# EAGLE design mini_controller_m328 (EAGLE 9.6.2)
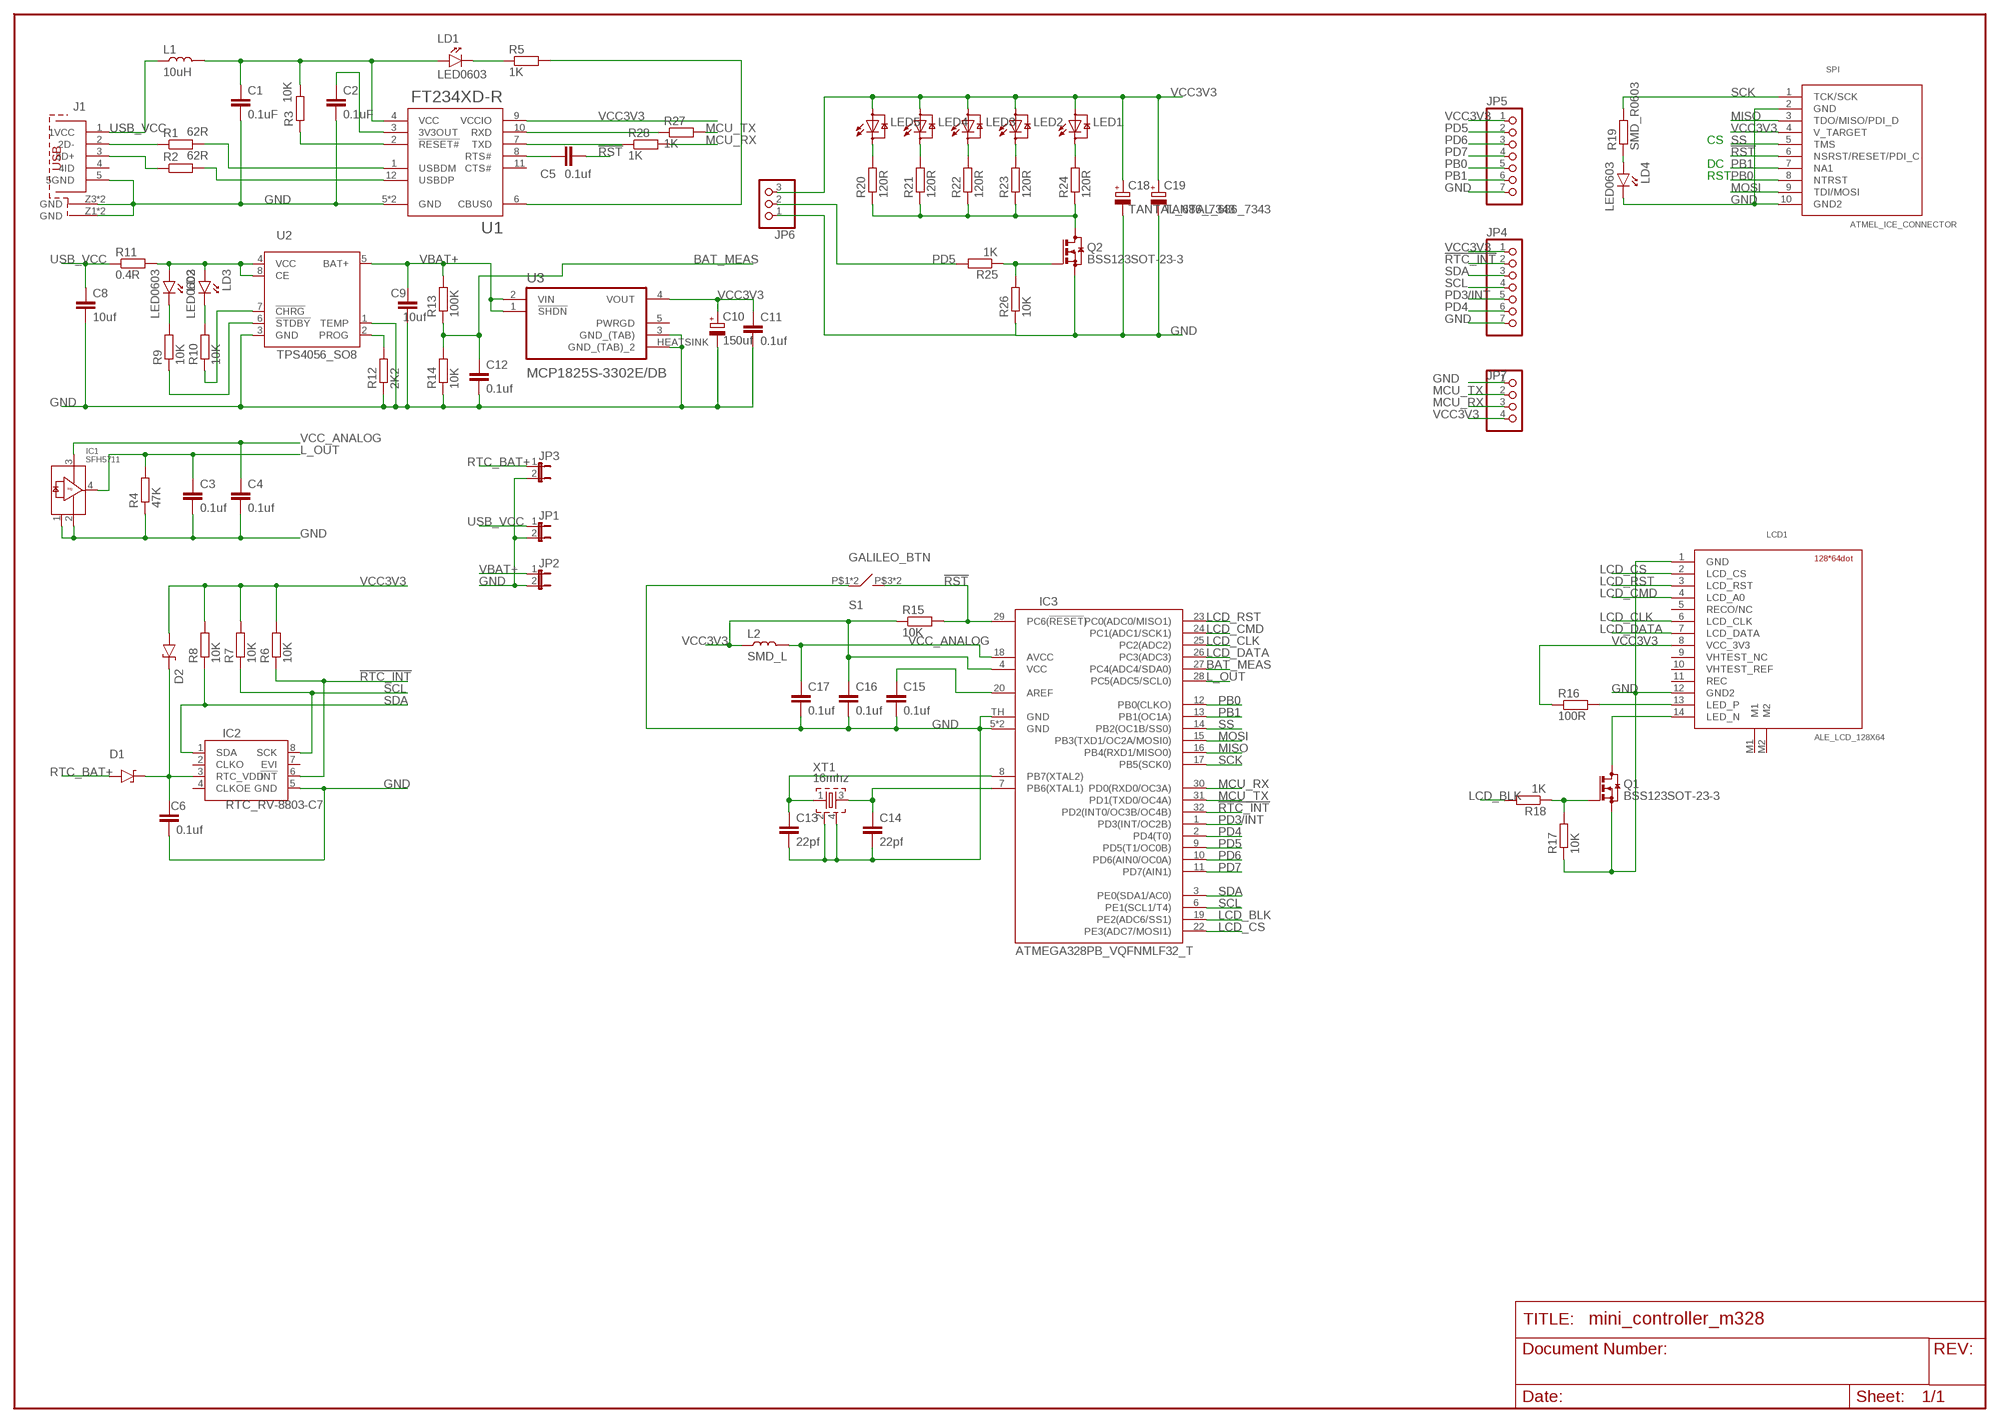
[diagram p0: schematic, sheet 1]

## Parts
C1  0.1uF  SMD_C0603  [0603]
C2  0.1uF  SMD_C0603  [0603]
C3  0.1uf  SMD_C0603  [0603]
C4  0.1uf  SMD_C0603  [0603]
C5  0.1uf  SMD_C0603  [0603]
C6  0.1uf  SMD_C0603  [0603]
C8  10uf  SMD_C1206  [1206]
C9  10uf  SMD_C1206  [1206]
C10  150uf  TANTAL_150UF_3528  [KA-3528ASYC]
C11  0.1uf  SMD_C0603  [0603]
C12  0.1uf  SMD_C0603  [0603]
C13  22pf  SMD_C0603  [0603]
C14  22pf  SMD_C0603  [0603]
C15  0.1uf  SMD_C0603  [0603]
C16  0.1uf  SMD_C0603  [0603]
C17  0.1uf  SMD_C0603  [0603]
C18  TANTAL_686_7343  [D/7343-31R]
C19  TANTAL_686_7343  [D/7343-31R]
D1  D_SOD323  [SOD-323_D]
D2  D_SOD323  [SOD-323_D]
IC1  SFH5711  [SFH5711]
IC2  RTC_RV-8803-C7  [C7_RTC]
IC3  ATMEGA328PB_VQFNMLF32_T  [MLF32-TH]
J1  MINI_USB_TYP_B_@  [65100516121]
JP1  JP1E  [JP1]
JP2  JP1E  [JP1]
JP3  JP1E  [JP1]
JP4  PINHD-1X7  [1X07]
JP5  PINHD-1X7  [1X07]
JP6  PINHD-1X3  [1X03]
JP7  PINHD-1X4  [1X04]
L1  10uH  SMD_L  [0805]
L2  SMD_L  [0805]
LCD1  ALE_LCD_128X64  [ALE_LCD_14PIN_CONNECTOR]
LD1  LED0603  [0603_P]
LD2  LED0603  [0603_P]
LD3  LED0603  [0603_P]
LD4  LED0603  [0603_P]
LED1  GM5BW96385A  [GM5BW96385A]
LED2  GM5BW96385A  [GM5BW96385A]
LED3  GM5BW96385A  [GM5BW96385A]
LED4  GM5BW96385A  [GM5BW96385A]
LED5  GM5BW96385A  [GM5BW96385A]
Q1  BSS123SOT-23-3  [SOT-23(3)]
Q2  BSS123SOT-23-3  [SOT-23(3)]
R1  62R  SMD_R0603  [0603]
R2  62R  SMD_R0603  [0603]
R3  10K  SMD_R0603  [0603]
R4  47K  SMD_R0603  [0603]
R5  1K  SMD_R0603  [0603]
R6  10K  SMD_R0603  [0603]
R7  10K  SMD_R0603  [0603]
R8  10K  SMD_R0603  [0603]
R9  10K  SMD_R0603  [0603]
R10  10K  SMD_R0603  [0603]
R11  0.4R  SMD_R1206  [1206]
R12  2K2  SMD_R0603  [0603]
R13  100K  SMD_R0603  [0603]
R14  10K  SMD_R0603  [0603]
R15  10K  SMD_R0603  [0603]
R16  100R  SMD_R0603  [0603]
R17  10K  SMD_R0603  [0603]
R18  1K  SMD_R0603  [0603]
R19  SMD_R0603  [0603]
R20  120R  SMD_R1206  [1206]
R21  120R  SMD_R1206  [1206]
R22  120R  SMD_R1206  [1206]
R23  120R  SMD_R1206  [1206]
R24  120R  SMD_R1206  [1206]
R25  1K  SMD_R0603  [0603]
R26  10K  SMD_R0603  [0603]
R27  1K  SMD_R0603  [0603]
R28  1K  SMD_R0603  [0603]
S1  GALILEO_BTN  [GALILEO_VERT_BTN]
SPI  ATMEL_ICE_CONNECTOR  [MINI10P_SPI/JTAG/PDI]
U1  FT234XD-R  [IC_FT234XD-R]
U2  TPS4056_SO8  [SO8]
U3  MCP1825S-3302E/DB  [SOT230P700X180-4N]
XT1  16mhz  QUARTZ_ZQ  [QUARTZ_3X3MM]

## Nets
!CHRG: R10.1 U2.7(!CHRG)
!RST: C5.2 IC3.29(PC6(!RESET!)) R15.2 S1.P$3 S1.P$4 SPI.6(NSRST/RESET/PDI_C)
!RTC_INT: IC2.6(!INT) IC3.32(PD2(INT0/OC3B/OC4B)) JP4.2 R6.1
BAT_MEAS: C12.1 IC3.27(PC4(ADC4/SDA0)) R13.1 R14.2
DM1: J1.2(2D-) R1.1
DM2: R1.2 U1.1(USBDM)
DP1: J1.3(3D+) R2.1
DP2: R2.2 U1.12(USBDP)
GND: C1.2 C2.2 C3.2 C4.2 C6.2 C8.2 C9.2 C10.M(-) C11.2 C12.2 C13.2 C14.2 C15.2 C16.2 C17.2 C18.- C19.- IC1.1 IC1.2 IC2.5(GND) IC3.5(GND) IC3.21(GND) IC3.TH(GND) J1.5(5GND) J1.Z1(GND) J1.Z2(GND) J1.Z3(GND) J1.Z4(GND) JP1.2 JP2.2 JP3.2 JP4.7 JP5.7 JP6.1 JP7.1 LCD1.1(GND) LCD1.12(GND2) LD4.1(K) Q1.2(S) Q2.2(S) R4.1 R12.1 R14.1 R17.1 R26.1 S1.P$1 S1.P$2 SPI.2(GND) SPI.10(GND2) U1.5(GND) U1.13(GND) U2.1(TEMP) U2.3(GND) U3.3(GND_(TAB)) U3.HEATSINK(GND_(TAB)_2) XT1.2 XT1.4
L_OUT: C3.1 IC1.4 IC3.28(PC5(ADC5/SCL0)) R4.2
LCD_BLK: IC3.19(PE2(ADC6/SS1)) R18.2
LCD_CLK: IC3.25(PC2(ADC2)) LCD1.6(LCD_CLK)
LCD_CMD: IC3.24(PC1(ADC1/SCK1)) LCD1.4(LCD_A0)
LCD_CS: IC3.22(PE3(ADC7/MOSI1)) LCD1.2(LCD_CS)
LCD_DATA: IC3.26(PC3(ADC3)) LCD1.7(LCD_DATA)
LCD_RST: IC3.23(PC0(ADC0/MISO1)) LCD1.3(LCD_RST)
MCU_RX: IC3.30(PD0(RXD0/OC3A)) JP7.3 R28.2
MCU_TX: IC3.31(PD1(TXD0/OC4A)) JP7.2 R27.2
MISO: IC3.16(PB4(RXD1/MISO0)) SPI.3(TDO/MISO/PDI_D)
MOSI: IC3.15(PB3(TXD1/OC2A/MOSI0)) SPI.9(TDI/MOSI)
N$1: LCD1.13(LED_P) R16.2
N$2: LCD1.14(LED_N) Q1.3(D)
N$3: R9.1 U2.6(!STDBY)
N$4: Q1.1(G) R17.2 R18.1
N$5: LD2.1(K) R9.2
N$6: LD3.1(K) R10.2
N$7: C1.1 L1.2 LD1.2(A) R3.2 U1.4(VCC)
N$8: C13.1 IC3.8(PB7(XTAL2)) XT1.1
N$9: C2.1 U1.3(3V3OUT)
N$10: LD1.1(K) R5.1
N$11: R5.2 U1.6(CBUS0)
N$12: C14.1 IC3.7(PB6(XTAL1)) XT1.3
N$13: LD2.2(A) LD3.2(A) R11.2 U2.4(VCC) U2.8(CE)
N$14: R27.1 U1.10(RXD)
N$15: C5.1 U1.8(RTS#)
N$16: LD4.2(A) R19.1
N$17: LED5.C R20.2
N$18: R12.2 U2.2(PROG)
N$19: C6.1 D1.K D2.K IC2.3(RTC_VDD)
N$20: C15.1 IC3.20(AREF)
N$21: LED4.C R21.2
N$22: LED3.C R22.2
N$23: LED2.C R23.2
N$24: LED1.C R24.2
N$25: Q2.1(G) R25.1 R26.2
N$26: Q2.3(D) R20.1 R21.1 R22.1 R23.1 R24.1
N$27: R28.1 U1.7(TXD)
PB0: IC3.12(PB0(CLKO)) JP5.5 SPI.8(NTRST)
PB1: IC3.13(PB1(OC1A)) JP5.6 SPI.7(NA1)
PD3/INT: IC3.1(PD3(INT/OC2B)) JP4.5
PD4: IC3.2(PD4(T0)) JP4.6
PD5: IC3.9(PD5(T1/OC0B)) JP5.2 JP6.2 R25.2
PD6: IC3.10(PD6(AIN0/OC0A)) JP5.3
PD7: IC3.11(PD7(AIN1)) JP5.4
RTC_BAT+: D1.A JP3.1
SCK: IC3.17(PB5(SCK0)) R19.2 SPI.1(TCK/SCK)
SCL: IC2.8(SCK) IC3.6(PE1(SCL1/T4)) JP4.4 R7.1
SDA: IC2.1(SDA) IC3.3(PE0(SDA1/AC0)) JP4.3 R8.1
SER_RST: R3.1 U1.2(!RESET#)
SS: IC3.14(PB2(OC1B/SS0)) SPI.5(TMS)
USB_VCC: C8.1 J1.1(1VCC) JP1.1 L1.1 R11.1
VBAT+: C9.1 JP2.1 R13.2 U2.5(BAT+) U3.1(!SHDN) U3.2(VIN)
VCC3V3: C10.P(+) C11.1 C16.1 C18.+ C19.+ D2.A IC3.4(VCC) JP4.1 JP5.1 JP6.3 JP7.4 L2.1 LCD1.8(VCC_3V3) LED1.A LED2.A LED3.A LED4.A LED5.A R6.2 R7.2 R8.2 R15.1 R16.1 SPI.4(V_TARGET) U1.9(VCCIO) U3.4(VOUT)
VCC_ANALOG: C4.1 C17.1 IC1.3 IC3.18(AVCC) L2.2
Unconnected: IC2.2(CLKO) IC2.4(CLKOE) IC2.7(EVI) J1.4(4ID) LCD1.5(RECO/NC) LCD1.9(VHTEST_NC) LCD1.10(VHTEST_REF) LCD1.11(REC) LCD1.M1 LCD1.M2 U1.11(CTS#) U3.5(PWRGD)

## Notes on the sheet
- CS
- DC
- RST

## Library data of the parts
C1-C6 C8 C9 C11-C17 = passive_components:SMD_C
C10 = passive_components:TANTAL_150UF_3528
C18 C19 = passive_components:TANTAL_686_7343
D1 D2 = rcl:D_SOD323
IC1 = SFH5711:SFH5711; AVAILABILITY: Unavailable; DESCRIPTION: Optical Sensor Ambient 555nm Current 4-SMD, No Lead; MF: OSRAM Opto; MP: SFH5711; PACKAGE: SMD-4 OSRAM Opto; PRICE: None
IC2 = my_IC:RTC_RV-8803-C7
IC3 = my_IC:ATMEGA328PB_VQFN
J1 = passive_components:MINI_USB_TYP_B_@
JP1-JP3 = jumper:JP1E: JUMPER
JP4 JP5 = pinhead:PINHD-1X7: PIN HEADER
JP6 = pinhead:PINHD-1X3: PIN HEADER
JP7 = pinhead:PINHD-1X4: PIN HEADER
L1 L2 = passive_components:SMD_L
LCD1 = passive_components:ALE_LCD_128X64
LD1-LD4 = passive_components:LED
LED1-LED5 = led:GM5BW96385A: High brightness White Color LED 2300 mcd @ IF = 20mA achieved via InGaN Blue LED chip in combination with Yellow Phosphor Source: http://document.sharpsma.com/files/GM5BW96385A.pdf
Q1 Q2 = passive_components:BSS123: N-CHANNEL MOS FET
R1-R28 = passive_components:SMD_R
S1 = passive_components:GALILEO_BTN
SPI = passive_components:ATMEL_ICE_CONNECTOR
U1 = my_IC:FT234XD-R: USB Bridge, USB to UART USB 2.0 UART Interface 12-DFN (3x3); AVAILABILITY: Unavailable; DESCRIPTION: USB Bridge, USB to UART USB 2.0 UART Interface 12-DFN (3x3); MF: FTDI,; MP: FT234XD-R; PACKAGE: DFN-12 FTDI; PRICE: None
U2 = my_IC:TPS4056_SO8
U3 = my_IC:MCP1825S-3302E/DB; AVAILABILITY: Unavailable; DESCRIPTION: Linear Voltage Regulator IC 1 Output 500mA SOT-223-3; MF: Microchip; MP: MCP1825S-3302E/DB; PACKAGE: SOT-223 Microchip; PRICE: None
XT1 = passive_components:QUARTZ_ZQ

## Board
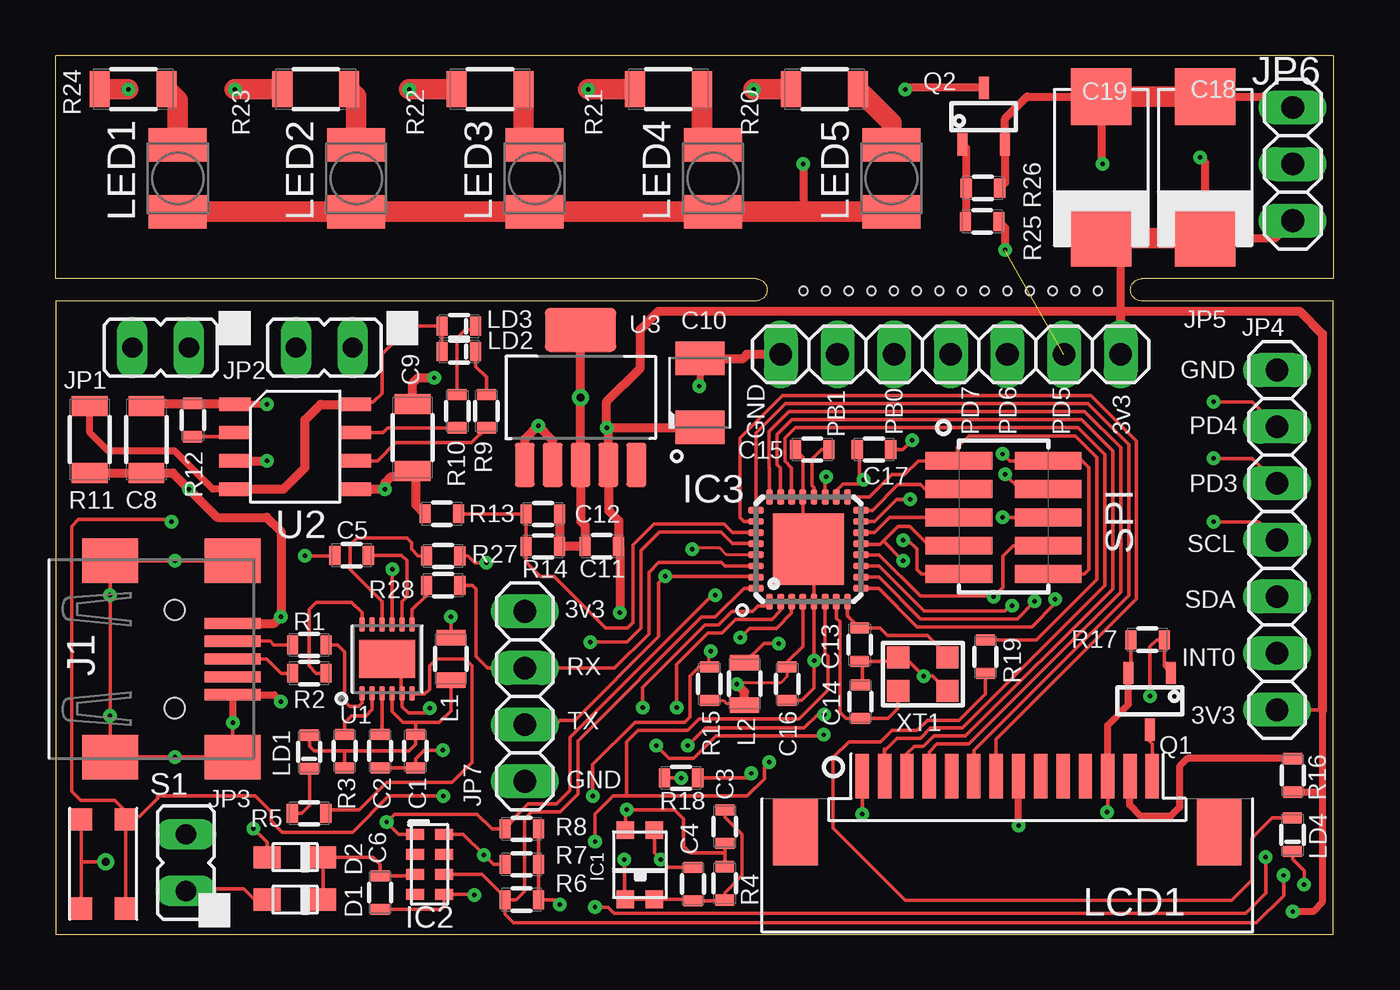
[diagram p1: board, top side]
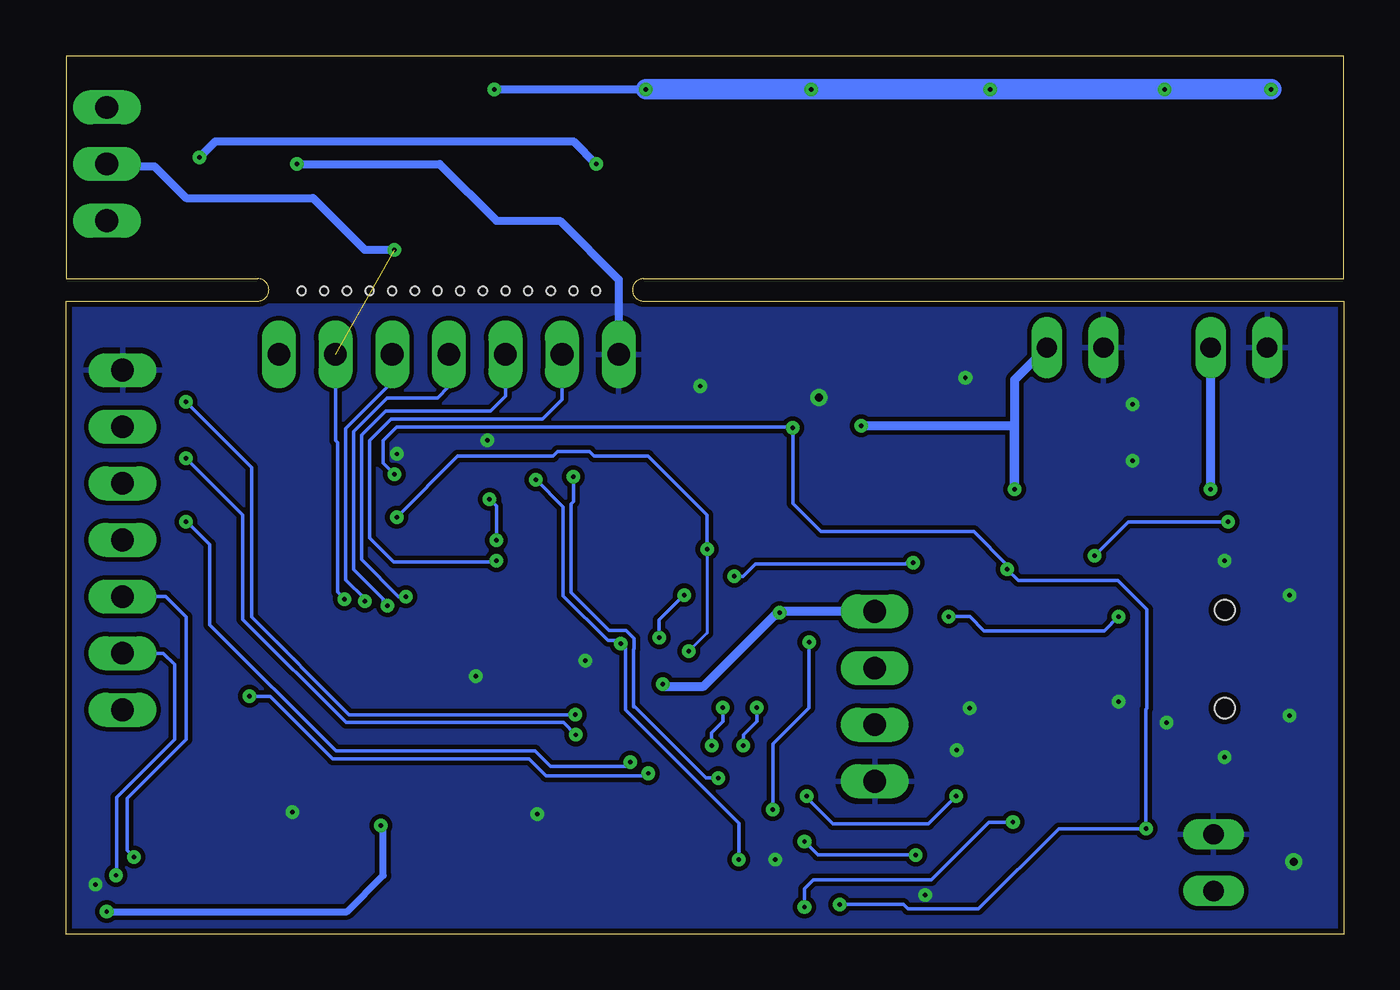
[diagram p2: board, bottom side, seen from below]

Size 57.3 x 39.4 mm. Coordinates in mm from the lower left corner, seen from the top.
Outline: 0,0 57.3,0 57.3,28.4 48.7,28.4 arc-180 48.7,29.4 57.3,29.4 57.3,39.4 0,39.4 0,29.4 31.4,29.4 arc-180 31.4,28.4 0,28.4 0,0
Copper layers (1*16): Top 0.035mm / dielectric 1.5mm / Bottom 0.035mm
Design rules "default *": minimum track width 4mil, minimum drill 0.2mm, track to track 8mil, track to pad 6mil, pad to pad 6mil, via to via 6mil, smd to smd 6mil, copper to edge 10mil, drill to drill 0.4mm, minimum pad ring 8mil, minimum via ring 8mil, stop-mask expansion 4mil, vias tented up to drill 20mil, thermal gap 10mil
Holes 0.35 mm at 33.53,28.85 34.54,28.85 35.56,28.85 36.58,28.85 37.59,28.85 38.61,28.85 39.62,28.85 40.64,28.85 41.66,28.85 42.67,28.85 43.69,28.85 44.7,28.85 45.72,28.85 46.74,28.85

### Footprints (pad centres in the part's own frame; a part is rotated, then mirrored left to right if it is on the bottom)
0603 = smd 0.85 x 0.5: 1 0,0.75; 2 0,-0.75
1206 = smd 1.6 x 0.9: 1 0,1.5; 2 0,-1.5
KA-3528ASYC = smd 1.5 x 2.2: M -1.55,0; P 1.55,0
D/7343-31R = smd 2.55 x 2.7: + 3.175,0; - -3.175,0
SOD-323_D = smd 1.2 x 1: A 1.25,0; K -1.25,0
SFH5711 = smd 0.8 x 0.8: 1 -0.65,-1.55; 2 0.65,-1.55; 3 0.65,1.55; 4 -0.65,1.55
C7_RTC = smd 0.8 x 0.5: 1 -0.65,1.35; 2 -0.65,0.45; 3 -0.65,-0.45; 4 -0.65,-1.35; 5 0.65,-1.35; 6 0.65,-0.45; 7 0.65,0.45; 8 0.65,1.35
MLF32-TH = smd 0.7 x 0.3: 1 -2.35,1.75; 2 -2.35,1.25; 3 -2.35,0.75; 4 -2.35,0.25; 5 -2.35,-0.25; 6 -2.35,-0.75; 7 -2.35,-1.25; 8 -2.35,-1.75; 17 2.35,-1.75; 18 2.35,-1.25; 19 2.35,-0.75; 20 2.35,-0.25; 21 2.35,0.25; 22 2.35,0.75; 23 2.35,1.25; 24 2.35,1.75 | smd 0.3 x 0.7: 9 -1.75,-2.35; 10 -1.25,-2.35; 11 -0.75,-2.35; 12 -0.25,-2.35; 13 0.25,-2.35; 14 0.75,-2.35; 15 1.25,-2.35; 16 1.75,-2.35; 25 1.75,2.35; 26 1.25,2.35; 27 0.75,2.35; 28 0.25,2.35; 29 -0.25,2.35; 30 -0.75,2.35; 31 -1.25,2.35; 32 -1.75,2.35 | smd 3.2 x 3.2: TH 0,0
65100516121 = smd 0.5 x 2.5: 1 -1.6,2.6; 2 -0.8,2.6; 3 0,2.6; 4 0.8,2.6; 5 1.6,2.6 | smd 2 x 2.5: Z1 -4.4,2.6; Z2 4.4,2.6; Z3 4.4,-2.9; Z4 -4.4,-2.9 | hole 0.9: -2.2,0; 2.2,0
JP1 = drill 0.914 long: 1 0,-1.27; 2 0,1.27
1X07 = drill 1.016 long: 1 -7.62,0; 2 -5.08,0; 3 -2.54,0; 4 0,0; 5 2.54,0; 6 5.08,0; 7 7.62,0
1X03 = drill 1.016 long: 1 -2.54,0; 2 0,0; 3 2.54,0
1X04 = drill 1.016 long: 1 -3.81,0; 2 -1.27,0; 3 1.27,0; 4 3.81,0
0805 = smd 1.3 x 0.7: 1 0,0.95; 2 0,-0.95
ALE_LCD_14PIN_CONNECTOR = smd 0.6 x 2: 1 6.5,-1; 2 5.5,-1; 3 4.5,-1; 4 3.5,-1; 5 2.5,-1; 6 1.5,-1; 7 0.5,-1; 8 -0.5,-1; 9 -1.5,-1; 10 -2.5,-1; 11 -3.5,-1; 12 -4.5,-1; 13 -5.5,-1; 14 -6.5,-1 | smd 2 x 3: M1 9.5,1.5; M2 -9.5,1.5
0603_P = smd 0.85 x 0.5: 1 0,0.75; 2 0,-0.75
GM5BW96385A = smd 1.5 x 2.6: A -1.5,0; C 1.5,0
SOT-23(3) = smd 0.45 x 1: 1 -0.95,-1.25; 2 0.95,-1.25; 3 0,1.29
GALILEO_VERT_BTN = smd 1 x 1: P$1 -2,1; P$2 2,1; P$3 -2,-1; P$4 2,-1
MINI10P_SPI/JTAG/PDI = smd 0.8 x 3: 1 0,-4; 2 0,0; 3 1.27,-4; 4 1.27,0; 5 2.54,-4; 6 2.54,0; 7 3.81,-4; 8 3.81,0; 9 5.08,-4; 10 5.08,0
IC_FT234XD-R = smd 0.65 x 0.25: 1 -1.55,1.125; 2 -1.55,0.675; 3 -1.55,0.225; 4 -1.55,-0.225; 5 -1.55,-0.675; 6 -1.55,-1.125; 7 1.55,-1.125; 8 1.55,-0.675; 9 1.55,-0.225; 10 1.55,0.225; 11 1.55,0.675; 12 1.55,1.125 | smd 1.7 x 2.5: 13 0,0
SO8 = smd 0.6 x 1.4: 1 -1.905,-2.7; 2 -0.635,-2.7; 3 0.635,-2.7; 4 1.905,-2.7; 5 1.905,2.7; 6 0.635,2.7; 7 -0.635,2.7; 8 -1.905,2.7
SOT230P700X180-4N = smd 1.97 x 0.89: 1 -3.025,2.5; 2 -3.025,1.25; 3 -3.025,0; 4 -3.025,-1.25; 5 -3.025,-2.5 | smd 1.97 x 3.19: HEATSINK 3.025,0
QUARTZ_3X3MM = smd 1 x 1: 1 -0.75,1.1; 2 0.75,1.1; 3 0.75,-1.1; 4 -0.75,-1.1

### Placement (x,y rotation side)
C1  16.13,8.22 0 top
C2  14.54,8.22 0 top
C3  30.01,4.83 180 top
C4  28.58,2.25 0 top
C5  13.27,16.99 270 top
C6  14.54,1.87 0 top
C8  4.07,22.19 180 top
C9  16.01,22.27 180 top
C10  28.88,24.28 270 top
C11  24.49,17.4 270 top
C12  21.85,18.85 90 top
C13  36.05,12.98 0 top
C14  36.09,10.43 180 top
C15  33.92,21.73 270 top
C16  32.8,11.23 0 top
C17  36.69,21.74 90 top
C18  51.54,34.39 270 top
C19  46.88,34.39 270 top
D1  10.73,1.55 180 top
D2  10.73,3.45 180 top
IC1  26.19,3.12 0 top
IC2  16.77,3.14 0 top
IC3  33.75,17.26 90 top
J1  5.34,12.34 270 top
JP1  4.7,26.31 90 top
JP2  12.04,26.31 90 top
JP3  5.84,3.21 0 top
JP4  54.76,17.68 90 top
JP5  40.14,26.01 180 top
JP6  55.47,34.54 270 top
JP7  21.03,10.67 90 top
L1  17.72,12.34 0 top
L2  30.9,11.23 180 top
LCD1  42.67,6.09 180 top
LD1  11.36,8.18 180 top
LD2  18.08,26.13 270 top
LD3  18.08,27.26 270 top
LD4  55.46,4.46 180 top
LED1  5.48,33.9 90 top
LED2  13.48,33.9 90 top
LED3  21.48,33.9 90 top
LED4  29.48,33.9 90 top
LED5  37.48,33.9 90 top
Q1  49.06,10.47 180 top
Q2  41.62,36.67 0 top
R1  11.37,12.98 90 top
R2  11.37,11.71 90 top
R3  12.96,8.22 0 top
R4  30,2.28 180 top
R5  11.36,5.42 90 top
R6  20.89,1.55 90 top
R7  20.89,3.14 90 top
R8  20.89,4.72 90 top
R9  19.31,23.46 180 top
R10  18,23.46 180 top
R11  1.53,22.19 180 top
R12  6.15,23.06 0 top
R13  17.31,18.86 270 top
R14  21.85,17.39 270 top
R15  29.31,11.23 180 top
R16  55.48,7.13 180 top
R17  48.96,13.21 90 top
R18  28.04,7.01 270 top
R19  41.69,12.44 180 top
R20  34.48,37.9 90 top
R21  27.48,37.9 90 top
R22  19.48,37.9 90 top
R23  11.66,37.9 90 top
R24  3.48,37.9 90 top
R25  41.54,31.96 90 top
R26  41.58,33.47 270 top
R27  17.37,16.97 90 top
R28  17.37,15.65 90 top
S1  2.13,3.15 90 top
SPI  44.5,21.23 270 top
U1  14.86,12.34 90 top
U2  10.73,21.87 270 top
U3  23.54,24.08 90 top
XT1  38.88,11.66 270 top

### Tracks (layer width: path | path; a pad name or v marks a point on that pad's centre or on a via)
!CHRG
  Top 0.152: R10.1 14.89,22.71 14.68,22.5 U2.7
!RST  (via drill 0.2)
  Top 0.127: v28.55,17.27 28.6,17.32 29.78,17.32 30.08,17.01 IC3.29 | v29.37,12.7 29.26,12.6 29.26,12.03 R15.2
  Top 0.152: SPI.6 v42.47,18.69 | v5.18,18.49 5.08,18.59 1.02,18.59 0.71,18.29 0.71,6.4 1.12,5.99 2.64,5.99 3.13,5.5 S1.P$4 | C5.2 12.49,16.97 v11.18,16.97 | R15.2 28.84,11.98 28.45,11.59 28.45,9.75 28.19,9.5 25.97,9.5 24.08,7.61 v24.08,6.2 | S1.P$4 S1.P$3 | S1.P$4 3.27,5.28 3.76,5.28 4.57,6.1 4.57,6.2 8.94,6.2 9.65,5.49 9.65,5.08 10.16,4.57 13.31,4.57 14.94,6.2 v17.37,6.2
  Bottom 0.127: v28.55,17.27 28.55,13.51 v29.37,12.7
  Bottom 0.152: v42.47,18.69 39.73,21.44 35.46,21.44 35.26,21.64 33.83,21.64 33.63,21.44 31.2,21.44 28.55,18.79 v28.55,17.27 | v5.18,18.49 9.65,18.49 v11.18,16.97 | v17.37,6.2 18.62,4.95 22.91,4.95 24.08,6.12 v24.08,6.2
!RTC_INT  (via drill 0.2)
  Top 0.152: IC2.6 19.12,2.69 20.14,1.66 R6.1 | R6.1 20.65,1.55 21.03,1.93 21.03,5.18 21.34,5.49 22.61,5.49 23.42,6.3 23.42,8.68 28.97,14.22 29.57,14.22 30.86,15.51 IC3.32 | R6.1 20.14,0.89 20.53,0.51 53.85,0.51 55.07,1.73 v55.07,2.64
  Bottom 0.152: v55.07,2.64 55.02,2.64 55.02,6.14 52.43,8.73 52.43,12.09 52.94,12.6 JP4.2
BAT_MEAS
  Top 0.152: R13.1 21.09,18.86 C12.1 R14.2 | R14.2 21.05,17.39 | IC3.27 30.35,18.01 29.97,18.39 26.82,18.39 25.88,17.45 25.88,13.98 25.64,13.74 24.66,13.74 22.35,16.05 21.74,16.05 21.1,16.7 R14.2
DM1
  Top 0.152: J1.2 9.62,13.14 9.78,12.98 R1.1
DM2
  Top 0.152: U1.1 13.74,10.37 13.59,10.22 13.17,10.22 12.96,10.44 12.96,12.66 12.64,12.98 R1.2
DP1
  Top 0.152: J1.3 9.46,12.34 10.1,11.71 R2.1
DP2
  Top 0.152: R2.2 11.69,11.71 11.37,12.03 11.37,14.56 11.69,14.88 13.28,14.88 13.74,14.42 U1.12
GND  (via drill 0.2, 0.35)
  Top 0.127: 34,12.17 v34,12.27
  Top 0.152: U1.13 15.5,11.71 15.5,10.83 U1.5 15.54,10.2 15.81,9.92 16.14,9.92 16.16,9.93 16.56,9.93 v16.77,10.13 | J1.Z1 v5.34,16.74 J1.Z4 v2.44,15.2 v2.44,9.8 J1.Z3 v5.34,7.94 J1.Z2 v7.94,9.48 | C2.2 C1.2 16.13,7.86 16.53,8.25 v17.36,8.25 | C6.2 17.29,1.11 17.42,1.25 IC2.5 18.75,1.78 v18.77,1.76 | 34,12.17 IC3.5 34,17.01 IC3.TH 33.5,17.51 IC3.21 33.5,21.41 C15.2 | v34,12.27 34,11.05 33.44,10.48 C16.2 | v25.5,3.35 25.5,1.61 IC1.1 IC1.2 28.5,1.57 C4.2 29.96,1.5 R4.1 30,1.86 30.79,2.64 30.79,4.47 30.01,5.25 C3.2 | C14.2 36.17,11.18 36.17,12.11 C13.2 37.6,12.23 XT1.4 | 37.84,12.47 XT1.4 | XT1.2 39.32,11.58 v38.92,11.58 38.08,12.41 XT1.4 | v38.41,22.15 38,21.74 C17.2 | 43.08,16.15 SPI.10 46.13,16.15 46.33,16.36 46.33,20.93 45.93,21.34 44.4,21.34 44.3,21.23 | SPI.2 44.3,21.23 | 44.3,21.23 42.78,21.23 v42.47,21.54 | LCD1.1 v36.17,5.39 v36.17,5.38 | LCD1.12 47.17,5.51 v47.14,5.49 | R17.1 48.21,11.81 Q1.2 | LD4.1 55.47,3.7 55.47,3.35 55.98,2.85 v55.98,2.23 | S1.P$1 1.13,3.25 | 1.13,3.25 S1.P$2 | 1.13,3.25 v2.23,3.25
  Top 0.305: 4.16,23.77 C8.2 | U2.1 v9.46,23.77 | v7.94,9.48 J1.5 9.79,10.74 v10.1,10.44 | C10.M 28.88,25.8 28.88,24.61 v28.86,24.59 | LCD1.12 47.17,9.37 48.11,10.31 Q1.2
  Top 0.356: v46.94,34.54 46.88,34.6 C19.- 43.56,37.56 42.57,36.57 Q2.2 42.57,33.71 R26.1 | C18.- 54.99,37.56 JP6.1
  Top 0.406: U3.3 23.54,21.02 | U2.3 v9.46,21.23 | U3.3 v23.54,24.07 U3.HEATSINK | U2.1 6.19,23.77 R12.1 6.11,23.77 4.16,23.77 | C9.2 16,24.71 16.26,24.96 v16.97,24.96 | JP5.7 30.99,26.01 30.79,25.8 28.88,25.8 | U3.3 23.54,18.53 23.74,18.32 C11.2 R14.1 C12.2 22.65,18.8
  Top 0.914: C19.- C18.-
  Bottom 0.356: v46.94,34.54 40.54,34.54 38,32 35.15,32 32.51,29.36 JP5.7
  pour Bottom: 0.14,28.22 0.14,0.09 57.14,0.09 57.14,28.22
L_OUT  (via drill 0.2)
  Top 0.152: R4.2 29.98,3.03 30.01,3.07 30.01,3.66 | 29.67,3.66 28.45,3.66 28.15,3.96 28.15,5.18 27.74,5.59 v25.61,5.59 25.54,5.52 IC1.4 | 29.77,3.66 29.67,3.66 | C3.1 30.01,3.66 | 29.67,3.66 30.01,3.66 | IC3.28 30.34,17.51 29.82,18.03 27.07,18.03 26.24,17.2 26.24,13.73 25.61,13.11 v23.98,13.11
  Bottom 0.152: v25.61,5.59 25.61,8.53 23.98,10.16 v23.98,13.11
LCD_BLK  (via drill 0.2)
  Top 0.152: IC3.19 34.5,20.48 v34.55,20.52 | v28.04,7.01 R18.2
  Bottom 0.152: v34.55,20.52 34.55,19.4 34.65,19.3 34.65,15.33 32.94,13.62 32.18,13.62 31.84,13.28 31.84,12.79 31.86,12.78 31.86,10.26 | 31.86,10.26 31.86,10.2 | 31.86,10.26 28.6,7.01 v28.04,7.01
LCD_CLK
  Top 0.152: IC3.25 31.4,22.47 32.73,23.8 46.28,23.8 48.11,21.97 48.11,15.19 41.17,8.25 LCD1.6
LCD_CMD
  Top 0.152: IC3.24 32,20.9 31.98,20.92 31.98,22.55 32.88,23.44 46.13,23.44 47.76,21.82 47.76,15.34 40.95,8.53 39.52,8.53 39.17,8.18 LCD1.4
LCD_CS
  Top 0.152: IC3.22 33,20.91 32.7,21.21 32.7,22.25 33.17,22.73 45.84,22.73 47.05,21.52 47.05,15.64 40.66,9.25 39.23,9.25 38.77,8.79 37.73,8.79 37.17,8.23 | LCD1.2 37.17,8.23 | 37.17,8.23 37.17,8.32
LCD_DATA
  Top 0.152: IC3.26 30.86,18.51 30.69,18.69 30.69,22.26 32.58,24.15 46.43,24.15 48.47,22.11 48.47,15.04 42.17,8.74 LCD1.7
LCD_RST
  Top 0.152: IC3.23 32.5,20.91 32.34,21.07 32.34,22.4 33.02,23.09 45.99,23.09 47.4,21.67 47.4,15.49 40.8,8.89 39.38,8.89 38.92,8.43 38.5,8.43 38.17,8.1 LCD1.3
MCU_RX
  Top 0.152: R28.2 18.69,15.65 18.85,15.49 18.85,12.46 19.36,11.94 JP7.3 25.06,11.94 26.59,13.47 26.59,16.23 27.03,16.67 29.86,16.67 30.02,16.51 IC3.30
  Bottom 0.152: JP7.3 19.76,11.94
MCU_TX  (via drill 0.2)
  Top 0.152: IC3.31 31.37,16.05 v27.33,16.05 27.03,15.75 27.03,13.35 23.28,9.6 22.61,9.6 22.4,9.4 JP7.2 | v19.31,16.66 18.8,16.66 18.49,16.97 R27.2
  Bottom 0.152: v19.31,16.66 19.61,16.66 19.66,16.61 26.37,16.61 26.93,16.05 v27.33,16.05
MISO
  Top 0.152: IC3.16 36.62,19.01 37.77,20.17 38.78,20.17 38.98,19.96 SPI.3
MOSI  (via drill 0.2)
  Top 0.152: IC3.15 36.7,18.51 37.7,19.51 v38.31,19.51 | v38,17.68 38.2,17.68 38.61,17.27 38.61,16.36 38.81,16.15 SPI.9
  Bottom 0.152: v38.31,19.51 38,19.2 v38,17.68
N$1
  Top 0.305: R16.2 50.75,7.88 50.39,7.52 50.39,5.69 49.99,5.28 48.67,5.28 48.16,5.79 48.16,7.08 LCD1.13
N$2
  Top 0.152: Q1.3 48.97,9.09 48.97,8.74 49.17,8.53 LCD1.14
N$3
  Top 0.152: R9.1 18.65,22.05 15.24,22.05 14.43,21.23 U2.6
N$4  (via drill 0.2)
  Top 0.152: Q1.1 49.71,12.02 R17.2 49.38,13.21 49.07,12.9 v49.07,10.67 | v31.19,7.21 30.99,7.01 R18.1
  Bottom 0.152: v49.07,10.67 48.14,10.67 45.34,7.86 36.52,7.86 35.76,7.1 31.3,7.1 v31.19,7.21
N$5
  Top 0.152: LD2.1 18.83,25.47 19.31,24.98 R9.2
N$6
  Top 0.152: LD3.1 18.69,27.13 18.39,27.13 18,26.74 R10.2
N$7
  Top 0.152: U1.4 15.09,10 15.59,9.5 16.13,9.5 | 16.13,9.5 17.2,9.5 17.72,10.02 L1.2 | 16.13,9.5 C1.1 16.13,8.51 15.85,8.23 12.9,8.23 | LD1.2 11.38,8.91 11.38,8.43 11.58,8.23 12.9,8.23 | 12.9,8.23 12.96,8.18 R3.2
N$8
  Top 0.152: XT1.1 40.03,12.46 39.09,13.41 37.29,13.41 36.97,13.73 C13.1 35.5,14.28 IC3.8
N$9
  Top 0.152: U1.3 14.64,9.06 C2.1
N$10
  Top 0.152: R5.1 11.02,5.42 11.38,5.78 11.38,7.41 LD1.1
N$11
  Top 0.152: U1.6 16.01,10.77 16.55,10.77 16.77,10.98 16.77,12.03 17.09,12.34 18.36,12.34 18.67,12.03 18.67,7.7 17.78,6.81 14.83,6.81 13.61,5.59 12.28,5.59 R5.2
N$12
  Top 0.152: XT1.3 37.77,10.14 37.32,9.68 C14.1 35.43,9.68 35.16,9.96 35.16,14.02 35,14.17 IC3.7
N$13
  Top 0.152: U2.8 | U2.8 13.53,23.86 14.24,23.86 14.63,24.26 14.63,26.01 15.89,27.27 LD3.2 LD2.2 | U2.8
  Top 0.305: U2.4 7.04,19.96 5.32,21.68 2.35,21.68 1.53,22.5 R11.2
  Top 0.406: U2.4 10.21,19.96 11.18,20.93 11.18,23.06 11.88,23.76 U2.8
N$14
  Top 0.152: R27.1 16.26,16.97 15.95,17.27 15.95,17.58 15.75,17.78 13.51,17.78 13.2,17.47 13.2,16.37 14.64,14.93 U1.10
N$15
  Top 0.152: U1.8 15.54,14.93 15.75,15.14 15.75,16.76 15.52,16.99 C5.1
N$16
  Top 0.152: R19.1 41.69,10.78 40.51,9.6 39.08,9.6 38.62,9.14 37.49,9.14 36.99,8.64 35.56,8.64 34.85,7.92 34.85,4.78 38.1,1.52 52.73,1.52 53.63,2.43 53.63,4.3 54.55,5.21 LD4.2
N$17
  Top 0.914: R20.2 37.48,36.4 LED5.C
N$18
  Top 0.152: U2.2 7.84,22.31 R12.2
N$19
  Top 0.152: D1.K D2.K 14.23,3.45 14.54,3.13 C6.1 16.05,2.62 IC2.3
N$20
  Top 0.152: IC3.20 34,20.03 33.91,20.12 33.91,21.3 34.34,21.73 C15.1
N$21
  Top 0.914: R21.2 28.98,35.9 LED4.C
N$22
  Top 0.914: R22.2 20.98,35.9 LED3.C
N$23
  Top 0.914: R23.2 13.48,37.59 LED2.C
N$24
  Top 0.914: R24.2 5.48,37.4 LED1.C
N$25
  Top 0.356: Q2.1 40.83,35.26 R26.2 40.83,32 R25.1
N$26  (via drill 0.2)
  Top 0.356: Q2.3 38.16,37.96 v38.1,37.9
  Top 0.914: R24.1 v3.25,37.9 | v31.29,37.9 R20.1 | R21.1 v23.88,37.9 | R22.1 v15.85,37.9 | R23.1 v8.03,37.9
  Bottom 0.356: v38.1,37.9 v31.29,37.9
  Bottom 0.914: v3.25,37.9 v8.03,37.9 v15.85,37.9 v23.88,37.9 v31.29,37.9
N$27
  Top 0.152: U1.7 15.99,14.56 16.62,15.2 R28.1
PB0  (via drill 0.2)
  Top 0.152: IC3.12 36.92,17.01 38.77,15.16 42.04,15.16 v42.07,15.14 42.47,15.54 42.47,16.97 42.93,17.42 SPI.8
  Bottom 0.152: JP5.5 37.59,24.13 38.26,23.47 42.98,23.47 44.05,22.4 44.05,16.81 42.38,15.14 v42.07,15.14
PB1  (via drill 0.2)
  Top 0.152: IC3.13 36.14,17.47 36.96,17.47 37.11,17.63 | v38,16.76 37.99,16.75 37.11,17.63 | SPI.7 39.17,17.42 38.31,18.29 37.77,18.29 37.11,17.63
  Bottom 0.152: JP5.6 35.05,23.98 35.92,23.11 42.73,23.11 43.69,22.15 43.69,17.77 42.61,16.69 38.18,16.69 38.1,16.76 v38,16.76
PD3/INT  (via drill 0.2)
  Top 0.152: IC3.1 31.82,14.73 31.5,14.73 31.24,14.48 30.34,14.48 29.73,13.87 29.11,13.87 26.32,11.07 v26.32,10.16 | v26.93,8.46 27.51,7.88 28.59,7.88 29.61,8.89 34.39,8.89 v34.44,8.94 | v51.92,21.34 53.65,21.34 JP4.5
  Bottom 0.152: v26.93,8.46 26.93,8.94 26.32,9.55 v26.32,10.16 | v34.44,8.94 34.99,9.49 44.74,9.49 49.38,14.13 49.38,18.8 v51.92,21.34
PD4  (via drill 0.2)
  Top 0.152: IC3.2 32.5,14.52 32.11,14.12 30.48,14.12 29.88,13.51 29.26,13.51 27.84,12.09 v27.84,10.16 | v34.45,9.85 34.15,9.85 33.55,9.25 29.14,9.25 v28.35,8.46 | v51.92,23.88 53.65,23.88 JP4.6
  Bottom 0.152: v34.45,9.85 44.59,9.85 48.97,14.22 48.97,20.93 v51.92,23.88 | v28.35,8.46 28.35,9.04 27.84,9.55 v27.84,10.16
PD5  (via drill 0.2)  (1 unrouted)
  Top 0.152: v44.81,15.04 44.81,14.83 43.77,13.79 38.63,13.79 36.91,15.51 IC3.9
  Top 0.356: R25.2 42.57,31.69 v42.57,30.68
  Bottom 0.152: JP5.2 45.22,25.81 45.22,22.15 45.11,22.05 45.11,15.34 v44.81,15.04
  Bottom 0.356: v42.57,30.68 43.89,30.68 46.23,33.02 51.92,33.02 53.34,34.44 55.37,34.44 JP6.2
PD6  (via drill 0.2)
  Top 0.152: v43.89,14.93 v43.89,14.92 43.12,14.15 38.78,14.15 36.91,16.01 IC3.10
  Bottom 0.152: JP5.3 42.67,24.77 44.76,22.69 44.76,15.9 43.89,15.04 v43.89,14.93
PD7  (via drill 0.2)
  Top 0.152: v42.88,14.73 42.79,14.73 42.56,14.5 38.92,14.5 36.91,16.51 IC3.11
  Bottom 0.152: JP5.4 40.13,24.56 40.64,24.05 42.9,24.05 44.4,22.54 44.4,16.36 43.08,15.04 43.08,14.94 v42.88,14.73
RTC_BAT+
  Top 0.152: D1.A 8.92,1.55 8.43,2.03 5.93,2.03 JP3.1
SCK
  Top 0.152: 40.44,21.23 38.67,21.23 38.07,20.62 37.49,20.62 36.48,19.61 IC3.17 | 40.44,21.23 SPI.1 | 40.44,21.23 40.44,21.84 40.95,22.35 45.72,22.35 46.69,21.38 46.69,15.9 43.98,13.19 R19.2
SCL  (via drill 0.2)
  Top 0.152: R7.1 19.62,3.13 v19.21,3.55 18.27,4.49 IC2.8 | IC3.6 34.5,12.62 34.64,12.49 34.64,10.96 33.33,9.65 28.85,9.65 28.34,9.14 26.11,9.14 25.6,8.63 25.6,6.2 | v51.92,18.49 53.95,18.49 JP4.4 | 25.6,6.2 24.99,6.2 24.18,5.39 v24.18,4.16 | v32,7.72 31.77,7.49 31.77,6.97 31,6.2 25.6,6.2
  Bottom 0.152: v24.18,4.16 23.57,3.55 v19.21,3.55 | v32,7.72 32.21,7.52 35.57,7.52 36.27,8.22 45.19,8.22 50.85,13.88 50.85,17.48 51.87,18.49 v51.92,18.49
SDA  (via drill 0.2)
  Top 0.152: 14.94,4.93 v14.84,5.03 | IC3.3 33,14.41 32.31,13.71 31.1,13.71 v30.7,13.31 | IC2.1 15.38,4.49 v14.84,5.03 | v24.18,1.22 24.77,1.22 25.05,0.94 53.37,0.94 54.25,1.83 v54.25,3.45 | v29.58,15.21 29.45,15.21 23.07,8.83 23.07,6.45 22.46,5.84 21.19,5.84 20.68,5.33 20.68,5.25 R8.1 19.56,4.72 18.9,5.38 15.19,5.38 v14.84,5.03
  Bottom 0.152: v29.58,15.21 30.7,14.1 v30.7,13.31 | v24.18,1.22 24.18,2.03 23.78,2.44 18.49,2.44 15.9,5.03 v14.84,5.03 | v54.25,3.45 54.56,3.76 54.56,6.1 51.92,8.74 51.92,14.22 52.84,15.14 JP4.3
SER_RST
  Top 0.152: U1.2 14.19,10.08 13.91,9.8 13.28,9.8 12.96,9.48 R3.1
SS
  Top 0.152: IC3.14 36.71,18.01 37.39,18.69 SPI.5
USB_VCC  (via drill 0.2)
  Top 0.152: L1.1 v17.72,14.25
  Top 0.406: J1.1 9.79,13.94 v10.1,14.25 10.1,18.06 9.46,18.69 7.24,18.69 v5.97,19.96 5.25,20.68 C8.1 R11.1
  Bottom 0.152: v17.72,14.25 16.77,14.25 16.13,13.61 10.73,13.61 v10.1,14.25
  Bottom 0.406: v5.97,19.96 JP1.1
VBAT+  (via drill 0.2)
  Top 0.406: U3.1 21.04,22.21 v21.63,22.81 22.29,22.15 U3.2 | U2.5 14.75,19.96 v14.76,19.95 14.76,20.24 15.04,20.52 16.16,20.52 | C9.1 16.16,20.62 16.16,20.52 | R13.2 16.16,19.27 16.16,20.52
  Bottom 0.406: 13.31,25.44 JP2.1 14.76,24.86 v14.76,19.95 14.76,22.81 v21.63,22.81
VCC3V3  (via drill 0.2)
  Top 0.127: C16.1 32.8,11.56 32.52,11.28 30.59,11.28 v30.53,11.22 30.89,10.87 30.89,10.36 | 30.89,10.36 L2.1 | R15.1 29.96,10.48 30.08,10.36 30.89,10.36
  Top 0.152: U1.9 15.09,16.37 v15.1,16.37 | U3.4 24.7,21.13 24.7,21.34 24.7,22.66 v24.7,22.71 | D2.A 9.48,4.12 v8.87,4.74 | v22.6,1.33 22.38,1.55 R6.2 R7.2 R8.2 | IC3.4 33.5,12.91 32.8,12.21 C16.1 | SPI.4 43.23,19.96 v42.57,20.62 | 56.79,16.04 56.8,16.05 | 56.8,10.06 56.79,10.06 JP4.1
  Top 0.305: C10.P 24.78,22.73 24.7,22.66 | 56.8,10.16 56.79,10.16 56.79,6.3 | v55.47,1.02 56.39,1.02 56.79,1.42 56.79,6.3 | v43.18,4.88 LCD1.8 | R16.1 56.72,6.38 56.79,6.3
  Top 0.356: C19.+ 47.75,30.34 47.75,27.94 | v51.31,34.85 51.54,34.61 C18.+ 54.69,31.21 JP6.3 | v33.53,34.54 33.53,32.4
  Top 0.406: L2.1 30.9,10.86 v30.53,11.22 | 56.8,10.06 56.8,10.16 56.8,16.05 56.8,26.92 55.78,27.94 47.86,27.94 | 47.86,27.94 47.75,27.94 27.03,27.94 26.22,27.13 26.22,25.4 24.7,23.89 v24.7,22.71 24.73,22.73 C10.P | JP5.1 47.76,27.84 47.86,27.94 | 24.73,21.31 24.7,21.34 | 24.78,22.73 24.79,22.73 U3.4 24.79,19 25.24,18.55 C11.1 25.3,17.34 v25.3,14.43
  Top 0.914: LED1.A LED2.A LED3.A LED4.A 33.53,32.4 LED5.A | C19.+ C18.+
  Bottom 0.152: v22.6,1.33 19.75,1.33 19.55,1.13 16.37,1.13 12.77,4.74 v8.87,4.74 8.87,10.08 8.83,10.12 8.83,14.56 10.12,15.86 14.6,15.86 v15.1,16.37 15.1,16.57 16.59,18.06 23.43,18.06 24.7,19.33 v24.7,22.71 24.76,22.76 42.47,22.76 43.08,22.14 43.08,21.13 v42.57,20.62
  Bottom 0.305: v55.47,1.02 44.7,1.02 43.08,2.64 43.08,4.78 v43.18,4.88
  Bottom 0.356: v51.31,34.85 50.6,35.56 34.54,35.56 v33.53,34.54
  Bottom 0.406: v30.53,11.22 30.43,11.12 28.7,11.12 25.5,14.32 25.4,14.32 v25.3,14.43 25.25,14.48 JP7.4
VCC_ANALOG  (via drill 0.2)
  Top 0.152: v32.42,13.04 31.75,13.04 L2.2 | IC1.3 26.84,3.64 v27.13,3.35 27.48,3 C4.1 | C17.1 36.05,21.64 36.05,20.57 v36.22,20.39 36.03,20.19 35.3,20.19 35,19.89 IC3.18
  Bottom 0.152: v36.22,20.39 35,19.17 35,15.18 33,13.18 32.42,13.18 v32.42,13.04 32.21,12.82 32.21,10.06 27.13,4.98 v27.13,3.35

### Text on the board
tNames: GND | PD4 | GND | PB1 | PB0 | PD7 | PD6 | PD5 | 3v3 | PD3 | SCL | 3v3 | SDA | INT0 | RX | TX | 3V3 | GND